# Altium project dental-unit-main v1_0.PrjPCB
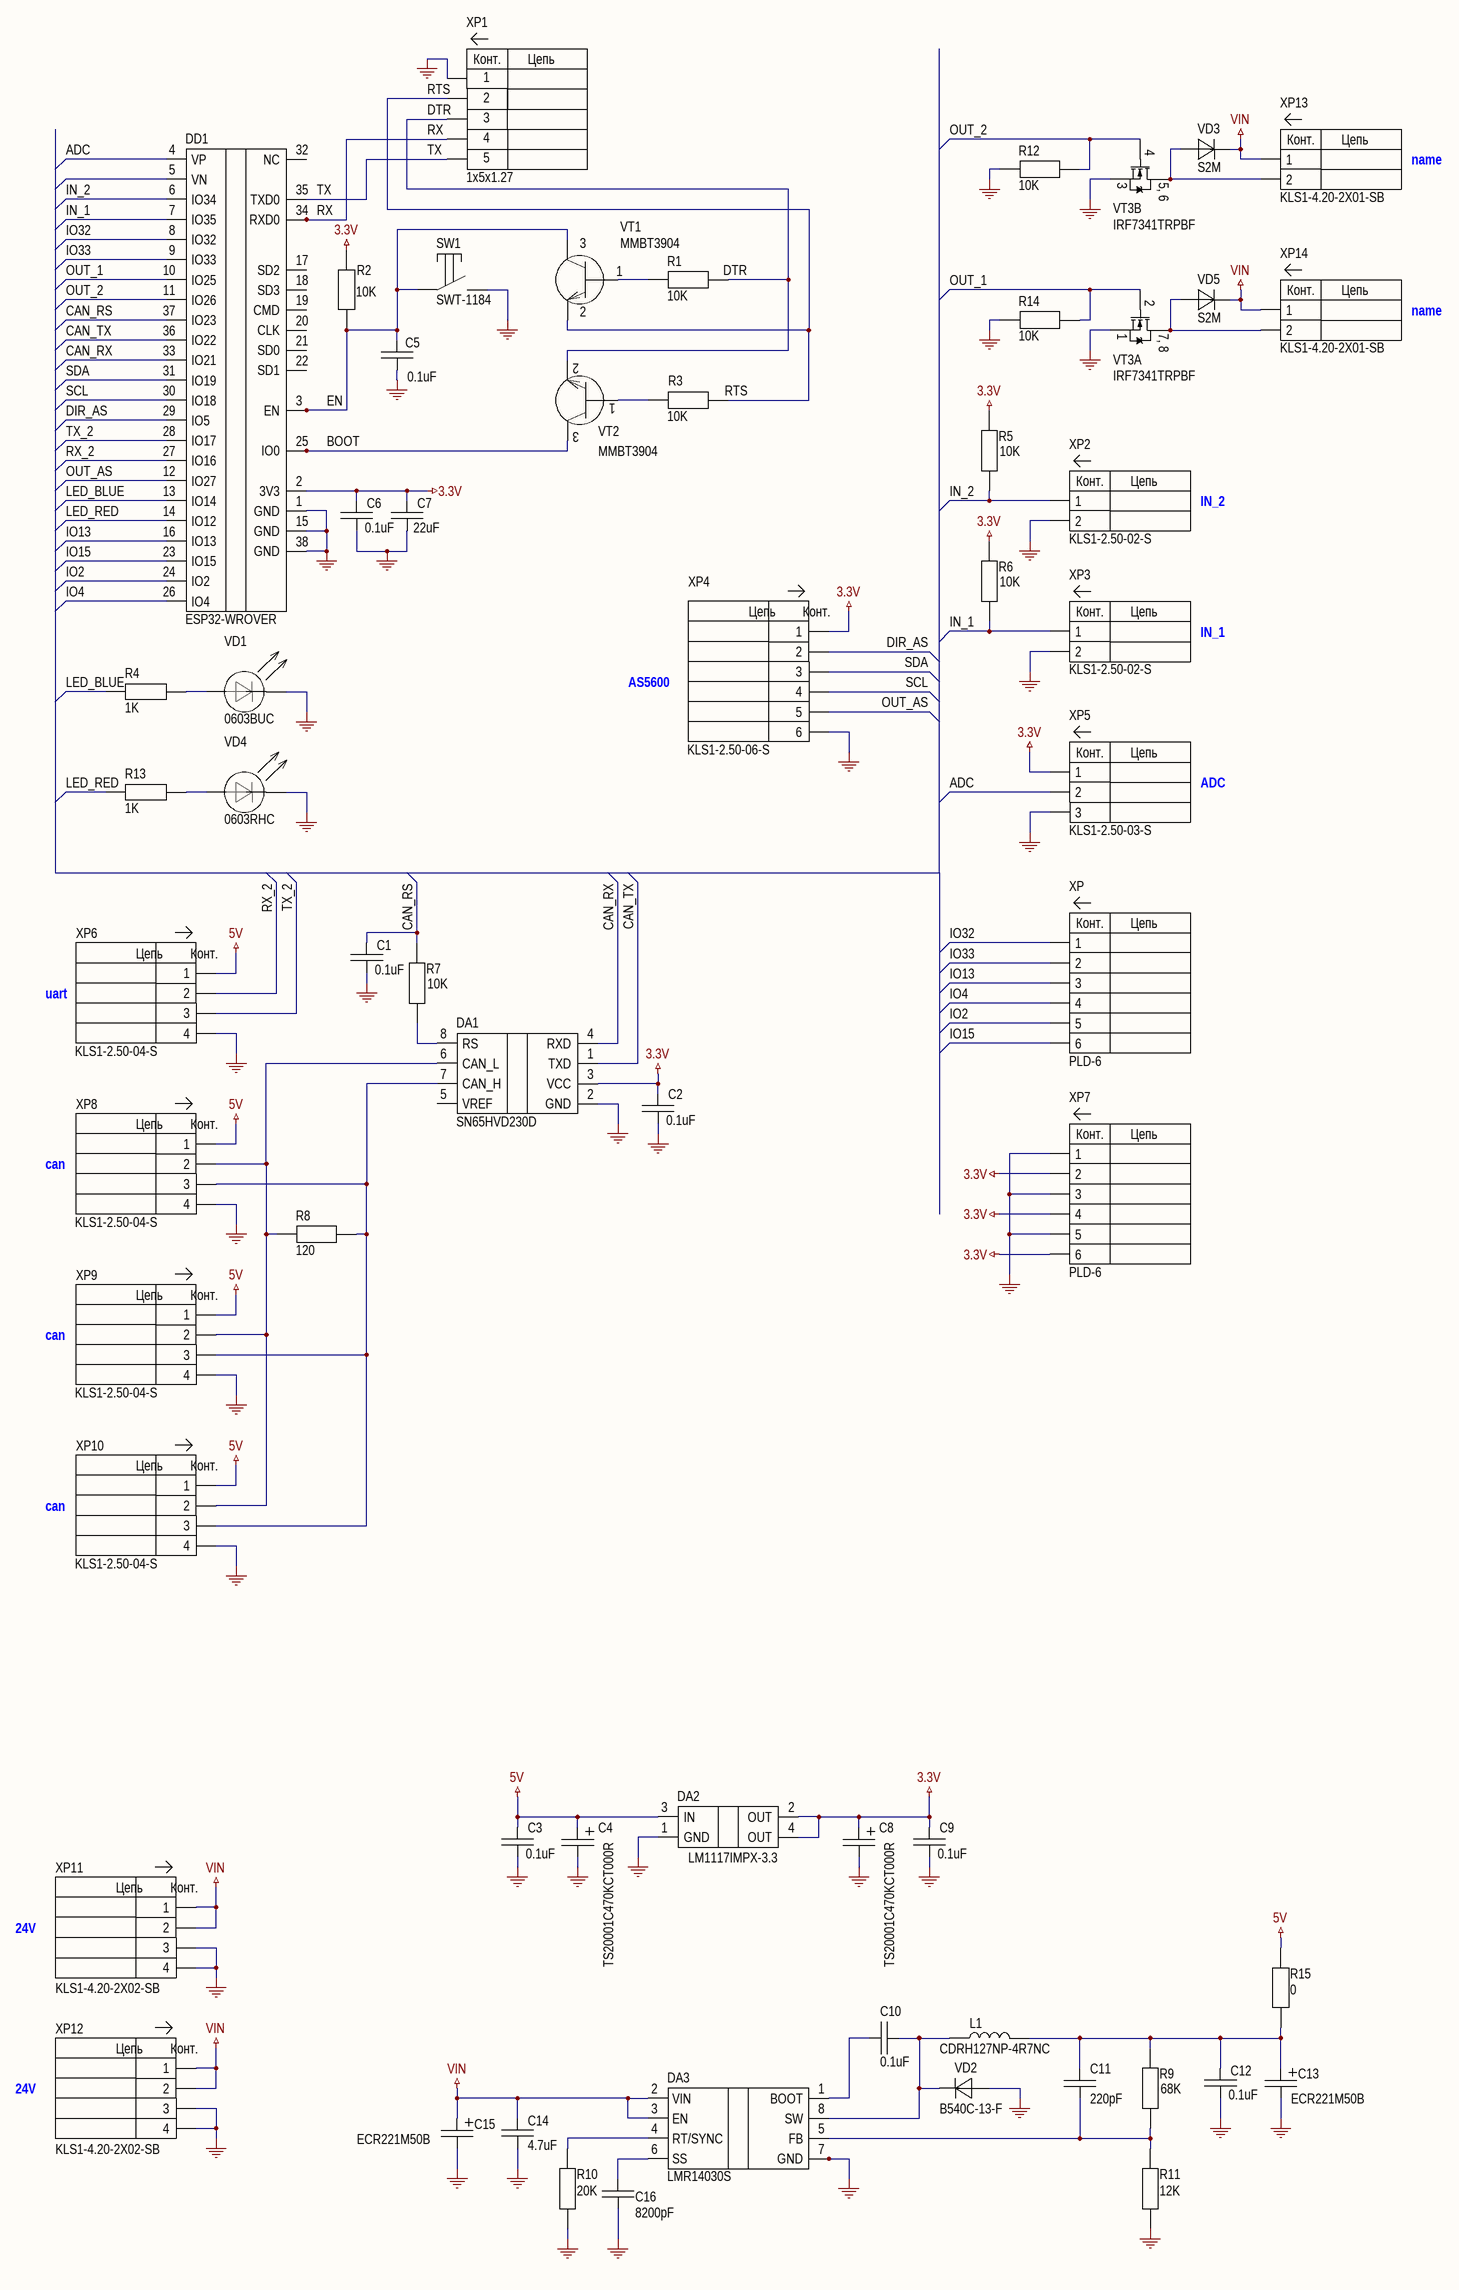
[diagram p0: dental-unit-main v1_0.SchDoc]
1 sheet, 60 parts. Net scope: global (net labels, ports and power ports of the same name join across sheets).
Board file: dental-unit-main v1_0.PcbDoc

## Sheet dental-unit-main v1_0.SchDoc
size 840 x 594 mm

### Parts
C1  value 0.1uF  [CC_0603]  (hidden comment: CC0603KRX7R5BB104)
C2  value 0.1uF  [CC_0603]  (hidden comment: CC0603KRX7R5BB104)
C3  value 0.1uF  [CC_0603]  (hidden comment: CC0603KRX7R5BB104)
C4  TS20001C470KCT000R  [CC_TANT_C]
C5  value 0.1uF  [CC_0603]  (hidden comment: CC0603KRX7R5BB104)
C6  value 0.1uF  [CC_0603]  (hidden comment: CC0603KRX7R5BB104)
C7  value 22uF  [CC_0805]  (hidden comment: GRM21BR60J226ME39L)
C8  TS20001C470KCT000R  [CC_TANT_C]
C9  value 0.1uF  [CC_0603]  (hidden comment: CC0603KRX7R5BB104)
C10  value 0.1uF  [CC_0805]  (hidden comment: CC0805JRX7R9BB104)
C11  value 220pF  [CC_0603]  (hidden comment: CC0603KRX7R9BB221)
C12  value 0.1uF  [CC_0603]  (hidden comment: CC0603KRX7R5BB104)
C13  ECR221M50B  [C_ele_10x13]
C14  value 4.7uF  [CC_0603]  (hidden comment: CL10A475KA8NQNC)
C15  ECR221M50B  [C_ele_10x13]
C16  value 8200pF  [CC_0603]  (hidden comment: CC0603KRX7R9BB822)
DA1  SN65HVD230D  [SOIC-8]
DA2  LM1117IMPX-3.3  [SOT-223]
DA3  LMR14030S  [SOIC-8N]
DD1  ESP32-WROVER  [ESP32-WROVER / WROOM]
L1  CDRH127NP-4R7NC  [CDRH127NP]
R1  value 10K  [RC_0603]  (hidden comment: AC0603FR-0710KL)
R2  value 10K  [RC_0603]  (hidden comment: AC0603FR-0710KL)
R3  value 10K  [RC_0603]  (hidden comment: AC0603FR-0710KL)
R4  value 1K  [RC_0603]  (hidden comment: AC0603FR-071KL)
R5  value 10K  [RC_0603]  (hidden comment: AC0603FR-0710KL)
R6  value 10K  [RC_0603]  (hidden comment: AC0603FR-0710KL)
R7  value 10K  [RC_0603]  (hidden comment: AC0603FR-0710KL)
R8  value 120  [RC_0603]  (hidden comment: RC0603FR-07120RL)
R9  value 68K  [RC_0603]  (hidden comment: RC0603FR-0768KL)
R10  value 20K  [RC_0603]  (hidden comment: RC0603FR-0720KL)
R11  value 12K  [RC_0603]  (hidden comment: RC0603FR-0712KL)
R12  value 10K  [RC_0603]  (hidden comment: AC0603FR-0710KL)
R13  value 1K  [RC_0603]  (hidden comment: AC0603FR-071KL)
R14  value 10K  [RC_0603]  (hidden comment: AC0603FR-0710KL)
R15  value 0  [RC_0603]  (hidden comment: AC0603FR-070RL)
SW1  SWT-1184  [IT-1184]
VD1  0603BUC  [LED_0603]
VD2  B540C-13-F  [DO-214AB(SMC)]
VD3  S2M  [DO-214AA(SMB)]
VD4  0603RHC  [LED_0603]
VD5  S2M  [DO-214AA(SMB)]
VT1  MMBT3904  [SOT-23-3]
VT2  MMBT3904  [SOT-23-3]
VT3  IRF7341TRPBF  [SOIC-8]  (parts A,B of 2)
XP  PLD-6  [PLD-6]
XP1  1x5x1.27  [XT_1x5x1.27_offset]
XP2  KLS1-2.50-02-S  name: IN_2  [KLS1-2.50-02-S]
XP3  KLS1-2.50-02-S  name: IN_1  [KLS1-2.50-02-S]
XP4  KLS1-2.50-06-S  name: AS5600  [KLS1-2.50-06-S]
XP5  KLS1-2.50-03-S  name: ADC  [KLS1-2.50-03-S]
XP6  KLS1-2.50-04-S  name: uart  [KLS1-2.50-04-S]
XP7  PLD-6  [PLD-6]
XP8  KLS1-2.50-04-S  name: can  [KLS1-2.50-04-S]
XP9  KLS1-2.50-04-S  name: can  [KLS1-2.50-04-S]
XP10  KLS1-2.50-04-S  name: can  [KLS1-2.50-04-S]
XP11  KLS1-4.20-2X02-SB  name: 24V  [KLS1-4.20-2X02-SB]
XP12  KLS1-4.20-2X02-SB  name: 24V  [KLS1-4.20-2X02-SB]
XP13  KLS1-4.20-2X01-SB  [KLS1-4.20-2X01-SB]
XP14  KLS1-4.20-2X01-SB  [KLS1-4.20-2X01-SB]

### Nets
3.3V: C2.2 C6.2 C7.2 C8.1 C9.2 DA1.3(VCC) DA2.2(OUT) DA2.4(OUT) DD1.2(3V3) R2.2 R5.2 R6.2 XP4.1 XP5.1 XP7.2 XP7.4 XP7.6
5V: C3.2 C4.1 DA2.3(IN) R15.2 XP6.1 XP8.1 XP9.1 XP10.1
GND: C1.1 C2.1 C3.1 C4.2 C5.1 C6.1 C7.1 C8.2 C9.1 C12.1 C13.2 C14.1 C15.2 C16.2 DA1.2(GND) DA2.1(GND) DA3.7(GND) DA3.9 DD1.1(GND) DD1.15(GND) DD1.38(GND) DD1.39(GND) R10.1 R11.1 R12.2 R14.2 SW1.2 VD1.2(C) VD2.1(A) VD4.2(C) VT3.1(S) VT3.3(S) XP1.1 XP2.2 XP3.2 XP4.6 XP5.3 XP6.4 XP7.1 XP7.3 XP7.5 XP8.4 XP9.4 XP10.4 XP11.3 XP11.4 XP12.3 XP12.4
VIN: C14.2 C15.1 DA3.2(VIN) DA3.3(EN) VD3.2(C) VD5.2(C) XP11.1 XP11.2 XP12.1 XP12.2 XP13.1 XP14.1
ADC: DD1.4(VP) XP5.2
BOOT: DD1.25(IO0) VT2.3(C)
CAN_RS: C1.2 DD1.37(IO23) R7.2
CAN_RX: DA1.4(RXD) DD1.33(IO21)
CAN_TX: DA1.1(TXD) DD1.36(IO22)
DIR_AS: DD1.29(IO5) XP4.2
DTR: R1.2 VT2.2(E) XP1.3
EN: C5.2 DD1.3(EN) R2.1 SW1.1 VT1.3(C)
IN_1: DD1.7(IO35) R6.1 XP3.1
IN_2: DD1.6(IO34) R5.1 XP2.1
IO2: DD1.24(IO2) XP.5
IO4: DD1.26(IO4) XP.4
IO13: DD1.16(IO13) XP.3
IO15: DD1.23(IO15) XP.6
IO32: DD1.8(IO32) XP.1
IO33: DD1.9(IO33) XP.2
LED_BLUE: DD1.13(IO14) R4.1
LED_RED: DD1.14(IO12) R13.1
OUT_1: DD1.10(IO25) R14.1 VT3.2(G)
OUT_2: DD1.11(IO26) R12.1 VT3.4(G)
OUT_AS: DD1.12(IO27) XP4.5
RTS: R3.2 VT1.2(E) XP1.2
RX: DD1.34(RXD0) XP1.4
RX_2: DD1.27(IO16) XP6.2
SCL: DD1.30(IO18) XP4.4
SDA: DD1.31(IO19) XP4.3
TX: DD1.35(TXD0) XP1.5
TX_2: DD1.28(IO17) XP6.3
NetC10_1: C10.1 DA3.8(SW) L1.1 VD2.2(C)
NetC10_2: C10.2 DA3.1(BOOT)
NetC11_1: C11.1 C12.2 C13.1 L1.2 R9.2 R15.1
NetC11_2: C11.2 DA3.5(FB) R9.1 R11.2
NetC16_1: C16.1 DA3.6(SS)
NetDA1_6: DA1.6(CAN_L) R8.2 XP8.2 XP9.2 XP10.2
NetDA1_7: DA1.7(CAN_H) R8.1 XP8.3 XP9.3 XP10.3
NetDA1_8: DA1.8(RS) R7.1
NetDA3_4: DA3.4(RT/SYNC) R10.2
NetR1_1: R1.1 VT1.1(B)
NetR3_1: R3.1 VT2.1(B)
NetR4_2: R4.2 VD1.1(A)
NetR13_2: R13.2 VD4.1(A)
NetVD3_1: VD3.1(A) VT3.5(D) VT3.6(D) XP13.2
NetVD5_1: VD5.1(A) VT3.7(D) VT3.8(D) XP14.2

Not connected (* = marked no-connect by the designer): DA1 5(VREF); DD1 5(VN) 17(SD2) 18(SD3) 19(CMD) 20(CLK) 21(SD0) 22(SD1) 32(NC)

### Notes on the sheet
- Перв. примен.
- Справ. №
- Подп. и дата
- Инв. № дубл.
- Взам. инв. №
- Разраб.
- Изм.
- Лист
- № докум.
- Подп.
- Дата
- Лит.
- Масса
- Масштаб
- Пров.
- Т.контр.
- Листов
- Инв. № подл.
- Утв.
- Н.контр.
- 2.106-A1
- Копировал
- Формат А1
- (in symbol IRF7341TRPBF, part A) 7, 8
- (in symbol IRF7341TRPBF, part B) 5, 6
- (in symbol KLS1-2.50-02-x) Конт.; Цепь
- (in symbol KLS1-2.50-03-x) Конт.; Цепь
- (in symbol KLS1-2.50-04-x) Цепь; Конт.
- (in symbol KLS1-2.50-06-x) Цепь; Конт.
- (in symbol KLS1-4.20-2X01-x) Конт.; Цепь
- (in symbol KLS1-4.20-2X02-x) Цепь; Конт.
- (in symbol XT_1x5x1_27) Конт.; Цепь
- (in symbol XT_PLD-6) Конт.; Цепь

### Library data of the parts
C1-C3 C5 C6 C9 C12 = C: Cap Ceramic, 0603, 0.1u, 10%, 16V, X7R (Yageo); type: CC0603KRX7R5BB104
C4 C8 = C_polar: 47uF, 16v, C, 10%, @SUNTAN,; value: 47uF; type: TS20001C470KCT000R
C7 = C: Cap Ceramic, 0805, 22u, 20%, 6.3V, X5R, -55 +85C (Murata); type: GRM21BR60J226ME39L
C10 = C: Cap Ceramic, 0805, 0.1u, 5%, 50V, X7R (Yageo); type: CC0805JRX7R9BB104
C11 = C: Cap Ceramic, 0603, 220pF, 10%, 50V, NP0, @YAGEO; type: CC0603KRX7R9BB221
C13 C15 = C_polar: alum. el. Cap, 50v, 220u, 20%, 13x20, @HITANO; value: 220uF; type: ECR221M50B
C14 = C: Cap Ceramic, 0603, 4.7u, 10%, 25V, X5R (Sumsung); type: CL10A475KA8NQNC
C16 = C: Cap Ceramic, 0603, 8200pF, 10%, 50V, X7R (Yageo); type: CC0603KRX7R9BB822
DA1 = SN65HVD230D: 3.3-V CAN TRANSCEIVERS, @TI; type: SN65HVD230D; ComponentLink1Description: link; ComponentLink1URL: https://www.elitan.ru/pdf/0/1/8/5/1/01851789.pdf
DA2 = LM1117IMPX-3.3: LDO, 3.3v, 0.8A, SOT-223, Texas Instruments; type: LM1117S-3.3
DA3 = LMR14030S: DC-DC Step-Down Converter, 40V, 3.5A, @TI; type: LMR14030S; ComponentLink1Description: link; ComponentLink1URL: https://www.elitan.ru/pdf/0/8/0/1/0/08010317.pdf
L1 = L: 4.7uH, 6.8A, @SUMIDA; type: 12.3x12.3; value: 4.7uH
R1-R3 R5-R7 R12 R14 = R: Res, 0603, 10K, 1%, 0.25W (ф. Yageo); type: AC0603FR-0710KL; power: 0.25W
R4 R13 = R: Res, 0603, 1K 1%, 0.25W (ф. Yageo); type: AC0603FR-071KL; power: 0.25W
R8 = R: Res, 0603, 120, 1%, 0.25W (ф. Yageo); type: RC0603FR-07120RL; power: 0.25W
R9 = R: Res, 0603, 68K, 1%, 0.25W (ф. Yageo); type: RC0603FR-0768KL; power: 0.25W
R10 = R: Res, 0603, 20K, 1%, 0.25W (ф. Yageo); type: RC0603FR-0720KL; power: 0.25W
R11 = R: Res, 0603, 12K, 1%, 0.25W (ф. Yageo); type: RC0603FR-0712KL; power: 0.25W
R15 = R: Res, 0603, 0, 1%, 0.25W (ф. Yageo); type: AC0603FR-070RL; power: 0.25W
SW1 = smd-side-push-button
VD1 = LED: Led, 0603, BLUE, 20mA, 125, 140MCD, CPMELEC
VD2 = D: type: B540C-13-F
VD3 VD5 = D: 1000В, 2А, 2,5мкс, SMB, @DIODES; type: S2M
VD4 = LED: Led, 0603, RED, 20mA, 125, 140MCD, CPMELEC
VT1 VT2 = N-P-N-SOT-23: type: MMBT3904
VT3 = IRF7341TRPBF: HEXFET Power MOSFET, Dual N-Channel Mosfet, 55 В, 4.7 А, 2 Вт, @INFIN; type: IRF7341TRPBF; ComponentLink1Description: link; ComponentLink1URL: https://www.elitan.ru/pdf/0/1/6/4/8/01648779.pdf
XP XP7 = XT_PLD-6: type: PLD-6
XP1 = XT_1x5x1_27: type: 1x5x1.27
XP2 XP3 = KLS1-2.50-02-x: 2.5mm, 2pin, KLS; ComponentLink1Description: link; ComponentLink1URL: https://www.triatron.ru/upload/catalog_photo/elements/pdf/212764.pdf
XP4 = KLS1-2.50-06-x: 2.5mm, 6pin, KLS; ComponentLink1Description: link; ComponentLink1URL: https://www.triatron.ru/upload/catalog_photo/elements/pdf/212764.pdf
XP5 = KLS1-2.50-03-x: 2.5mm, 3pin, KLS; ComponentLink1Description: link; ComponentLink1URL: https://www.triatron.ru/upload/catalog_photo/elements/pdf/212764.pdf
XP6 XP8-XP10 = KLS1-2.50-04-x: 2.5mm, 4pin, KLS; ComponentLink1Description: link; ComponentLink1URL: https://www.triatron.ru/upload/catalog_photo/elements/pdf/212764.pdf
XP11 XP12 = KLS1-4.20-2X02-x: 4.2mm, 4pin, KLS; ComponentLink1Description: link; ComponentLink1URL: https://www.elitan.ru/pdf/1/1/8/6/4/11864968.pdf
XP13 XP14 = KLS1-4.20-2X01-x: 4.2mm, 2pin, KLS; ComponentLink1Description: link; ComponentLink1URL: https://www.compel.ru/item-pdf/d2c05fb19c960dbad4692b49647edad7/ps/kls~kls1-4.20.pdf; name: name
DD1 = ESP32-WROVER: type: ESP32-WROOM-32D